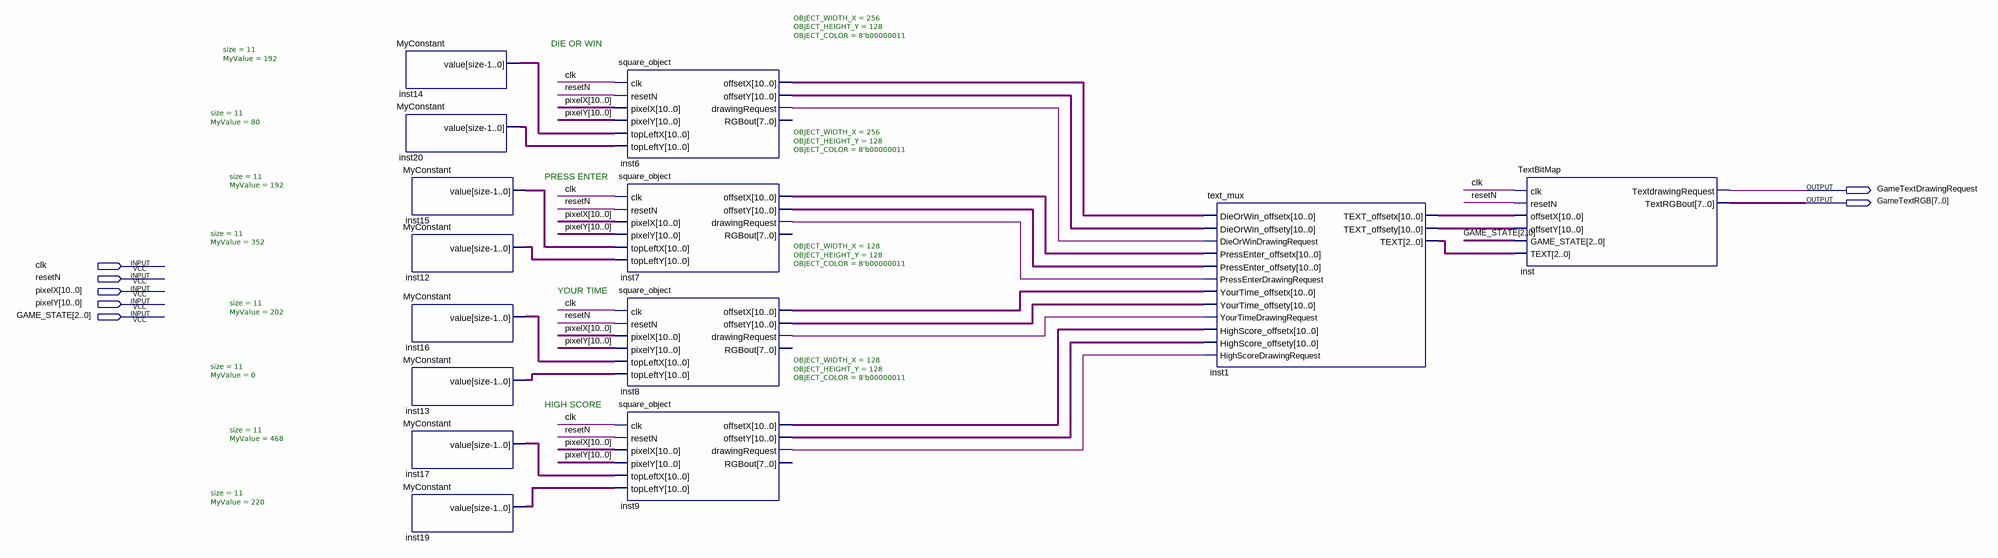
[diagram p0: schematic sheet]
// Quartus schematic GAME_TEXT.bdf as structural Verilog: 14 symbols, 7 pins
module GAME_TEXT (
  input  clk,
  input  resetN,
  input  [10:0] pixelX,
  input  [10:0] pixelY,
  input  [2:0] GAME_STATE,
  output GameTextDrawingRequest,
  output [7:0] GameTextRGB
);

  wire inst6_drawingrequest, inst7_drawingrequest, inst8_drawingrequest, inst9_drawingrequest;
  wire [2:0] inst1_text;
  wire [10:0] inst1_text_offsetx, inst1_text_offsety, inst6_offsetx, inst6_offsety, inst7_offsetx,
       inst7_offsety, inst8_offsetx, inst8_offsety, inst9_offsetx, inst9_offsety, inst12_value, inst13_value,
       inst14_value, inst15_value, inst16_value, inst17_value, inst19_value, inst20_value;

  MyConstant #(.size(11), .MyValue(192)) inst14 (.value(inst14_value));
  MyConstant #(.size(11), .MyValue(80)) inst20 (.value(inst20_value));
  MyConstant #(.size(11), .MyValue(192)) inst15 (.value(inst15_value));
  MyConstant #(.size(11), .MyValue(352)) inst12 (.value(inst12_value));
  MyConstant #(.size(11), .MyValue(202)) inst16 (.value(inst16_value));
  MyConstant #(.size(11), .MyValue(0)) inst13 (.value(inst13_value));
  MyConstant #(.size(11), .MyValue(468)) inst17 (.value(inst17_value));
  MyConstant #(.size(11), .MyValue(220)) inst19 (.value(inst19_value));
  square_object #(.OBJECT_WIDTH_X(256), .OBJECT_HEIGHT_Y(128), .OBJECT_COLOR(8'b00000011)) inst6 (
    .clk(clk), .resetN(resetN), .pixelX(pixelX), .pixelY(pixelY), .topLeftX(inst14_value),
    .topLeftY(inst20_value), .offsetX(inst6_offsetx), .offsetY(inst6_offsety),
    .drawingRequest(inst6_drawingrequest));  // open: RGBout
  square_object #(.OBJECT_WIDTH_X(256), .OBJECT_HEIGHT_Y(128), .OBJECT_COLOR(8'b00000011)) inst7 (
    .clk(clk), .resetN(resetN), .pixelX(pixelX), .pixelY(pixelY), .topLeftX(inst15_value),
    .topLeftY(inst12_value), .offsetX(inst7_offsetx), .offsetY(inst7_offsety),
    .drawingRequest(inst7_drawingrequest));  // open: RGBout
  square_object #(.OBJECT_WIDTH_X(128), .OBJECT_HEIGHT_Y(128), .OBJECT_COLOR(8'b00000011)) inst8 (
    .clk(clk), .resetN(resetN), .pixelX(pixelX), .pixelY(pixelY), .topLeftX(inst16_value),
    .topLeftY(inst13_value), .offsetX(inst8_offsetx), .offsetY(inst8_offsety),
    .drawingRequest(inst8_drawingrequest));  // open: RGBout
  square_object #(.OBJECT_WIDTH_X(128), .OBJECT_HEIGHT_Y(128), .OBJECT_COLOR(8'b00000011)) inst9 (
    .clk(clk), .resetN(resetN), .pixelX(pixelX), .pixelY(pixelY), .topLeftX(inst17_value),
    .topLeftY(inst19_value), .offsetX(inst9_offsetx), .offsetY(inst9_offsety),
    .drawingRequest(inst9_drawingrequest));  // open: RGBout
  text_mux inst1 (
    .DieOrWin_offsetx(inst6_offsetx), .DieOrWin_offsety(inst6_offsety),
    .DieOrWinDrawingRequest(inst6_drawingrequest), .PressEnter_offsetx(inst7_offsetx),
    .PressEnter_offsety(inst7_offsety), .PressEnterDrawingRequest(inst7_drawingrequest),
    .YourTime_offsetx(inst8_offsetx), .YourTime_offsety(inst8_offsety),
    .YourTimeDrawingRequest(inst8_drawingrequest), .HighScore_offsetx(inst9_offsetx),
    .HighScore_offsety(inst9_offsety), .HighScoreDrawingRequest(inst9_drawingrequest),
    .TEXT_offsetx(inst1_text_offsetx), .TEXT_offsety(inst1_text_offsety), .TEXT(inst1_text));
  TextBitMap inst (
    .clk(clk), .resetN(resetN), .offsetX(inst1_text_offsetx), .offsetY(inst1_text_offsety),
    .GAME_STATE(GAME_STATE), .TEXT(inst1_text), .TextdrawingRequest(GameTextDrawingRequest),
    .TextRGBout(GameTextRGB));

  // Notes on the sheet:
  //   DIE OR WIN
  //   PRESS ENTER
  //   YOUR TIME
  //   HIGH SCORE
endmodule
